# Altium project Buck_Converter.PrjPcb
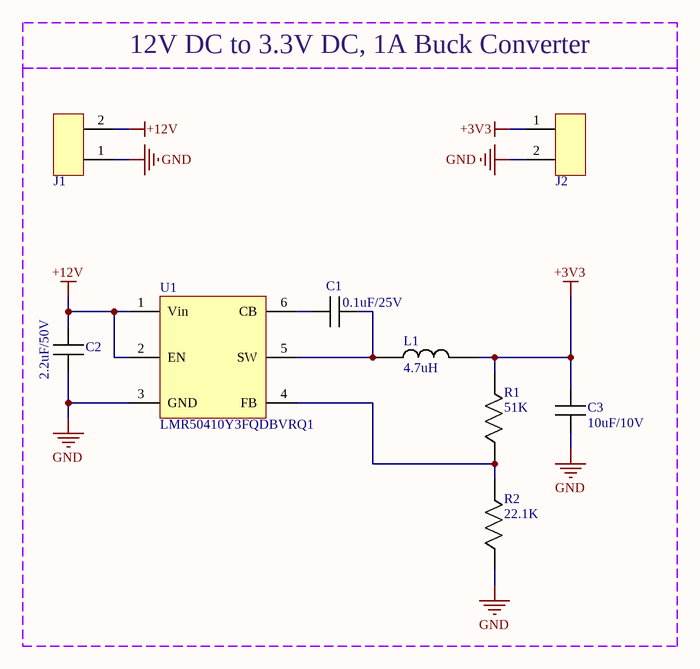
[diagram p0: Buck Converter.SchDoc]
1 sheet, 9 parts. Net scope: global (net labels, ports and power ports of the same name join across sheets).
Board file: Buck Converter.PcbDoc

## Sheet Buck Converter.SchDoc
size A3; SheetNumber: 1; SheetTotal: 1

### Parts
C1  0.1uF/25V  [CAP 0805]
C2  2.2uF/50V  [CAP 0805]
C3  10uF/10V  [CAP 0805]
J1  Header x2  [HEADER X2]  (value not drawn)
J2  Header x2  [HEADER X2]  (value not drawn)
L1  4.7uH  [IND_0628]
R1  51K  [RES 0805]
R2  22.1K  [RES 0805]
U1  LMR50410Y3FQDBVRQ1  [SOT23-6]

### Nets
+3V3: C3.2 J2.1 L1.2 R1.2
+12V: C2.2 J1.2 U1.1(Vin) U1.2(EN)
GND: C2.1 C3.1 J1.1 J2.2 R2.1 U1.3(GND)
NetC1_1: C1.1 L1.1 U1.5(SW)
NetC1_2: C1.2 U1.6(CB)
NetR1_1: R1.1 R2.2 U1.4(FB)

### Notes on the sheet
- 12V DC to 3.3V DC, 1A Buck Converter
- TANIM / DESCRIPTION
- DOSYA ADI / FILE NAME
- HAZIRLAYAN / PREPARED BY
- KONTROL EDEN / CHECKED BY
- YAYIN TARİHİ / REL DATE
- COMPANY NAME
- ONAYLAYAN / APPROVED BY
- ELECTRICAL - ELECTRONICS
- BÖLÜM  DEPARTMENT
- BOYUT / SIZE
- REVİZYON / REVISION
- SAYFA / SHEET
- ENGINEERING
- /

### Library data of the parts
C1 = CAP CER 0.1uF: 0.1 µF ±20% 25V Ceramic Capacitor X7R 0805 (2012 Metric); Manufacturer: KEMET; Manufacturer Part Number: C0805C104M3RAC7210; Supplier 1: Digikey; RoHS: Yes; Category: Ceramic Capacitors; Stock 1: 27572; Pricing 1: 1=0,1, 10=0,035, 100=0,0213, 1000=0,01423, 2500=0,01239, 5000=0,01125 (USD); RoHS Compliant: Yes; Supplier Part Number 1: 399-C0805C104M3RAC7210CT-ND
C2 = CAP CER 2.2uF: 2.2 µF ±10% 50V Ceramic Capacitor X7R 0805 (2012 Metric); Manufacturer: Yageo; Manufacturer Part Number: CC0805KKX7R9BB225; Material: 4241ConductorMaterial; Capacitance: 2.2uF; Supplier 1: Digikey; RoHS: Yes; Category: Ceramic Capacitors; Stock 1: 152900; Pricing 1: 1=0,33, 10=0,217, 100=0,1313, 1000=0,1036 (USD); Mount: Surface Mount; Case/Package: 0805; Case Code (Imperial): 0805; Case Code (Metric): 2012; Weight: 0.000194oz; Min Operating Temperature: -55°C; Max Operating Temperature: 125°C; Packaging: Tape and Reel; Voltage Rating: 50V; Tolerance: 10%; Dielectric: X7R; Termination: SMD/SMT; Voltage Rating (DC): 50V; Package Quantity: 3000; Series: CC; Length: 0.079inch; Width: 0.049inch; Height: 950um; Thickness: 0.057inch; Lead Free: Lead Free; Halogen Free: Halogen Free; RoHS Compliant: Yes; ComponentLink1URL: http://www.mouser.com/ds/2/447/Yageo_UPY-GP_NP0_16V-to-50V_9-358835.pdf?src-supplier=Mouser; ComponentLink1Description: http://www.mouser.com/ds/2/447/Yageo_UPY-GP_NP0_16V-to-50V_9-358835.pdf?src-supplier=Mouser; ComponentLink2URL: https://datasheet.octopart.com/CC0805KKX7R9BB225-Yageo-datasheet-166511530.pdf?src-supplier=Future+Electronics; ComponentLink2Description: https://datasheet.octopart.com/CC0805KKX7R9BB225-Yageo-datasheet-166511530.pdf?src-supplier=Future+Electronics; ComponentLink3URL: http://www.yageo.com/documents/recent/UPY-GPHC_X7R_6.3V-to-50V_18.pdf?src-supplier=Digikey; ComponentLink3Description: http://www.yageo.com/documents/recent/UPY-GPHC_X7R_6.3V-to-50V_18.pdf?src-supplier=Digikey; ComponentLink4URL: https://datasheet.octopart.com/CC0805KKX7R9BB225-Yageo-datasheet-151948686.pdf?src-supplier=Farnell; ComponentLink4Description: https://datasheet.octopart.com/CC0805KKX7R9BB225-Yageo-datasheet-151948686.pdf?src-supplier=Farnell; Supplier Part Number 1: 311-3420-6-ND
C3 = CAP CER 10uF: 10 µF ±10% 10V Ceramic Capacitor X7R 0805 (2012 Metric); Manufacturer: Murata; Manufacturer Part Number: GRM21BR71A106KA73L; Material: 4241ConductorMaterial; Capacitance: 10uF; Supplier 1: Digikey; RoHS: Yes; Category: Ceramic Capacitors; Stock 1: 594213; Pricing 1: 1=0,13, 10=0,081, 100=0,0518, 1000=0,03306 (USD); Mount: Surface Mount; Case/Package: 0805; Number of Pins: 2NUMBER; Case Code (Metric): 2012; Case Code (Imperial): 0805; Weight: 0.000335oz; Min Operating Temperature: -55°C; Max Operating Temperature: 125°C; Packaging: Tape and Reel; Voltage Rating: 10V; Termination: SMD/SMT; Voltage Rating (DC): 10V; Package Quantity: 3000; Series: GRM; Tolerance: 10%; Dielectric: X7R; Length: 0.079inch; Width: 0.049inch; Height: 1.25mm; Thickness: 0.055inch; RoHS Compliant: Yes; Reach SVHC Compliant: No; Supplier Part Number 1: 490-10516-1-ND
L1 = IND 4.7uH: Inductor Power Shielded/Molded Wirewound 4.7uH 20% 100KHz Ferrite 3A 0.031Ohm DCR 2424 T/R; Manufacturer: Abracon; Manufacturer Part Number: ASPI-0628-4R7M-T1; Supplier 1: Digikey; RoHS: Yes; Category: Fixed Inductors; Stock 1: 827; Pricing 1: 1=0,33, 10=0,275, 100=0,2202 (USD); ComponentLink1URL: http://www.abracon.com/Support/PackageDrawing/Magnetics/ASPI-0628.PDF?src-supplier=Digikey; ComponentLink1Description: http://www.abracon.com/Support/PackageDrawing/Magnetics/ASPI-0628.PDF?src-supplier=Digikey; ComponentLink2URL: https://abracon.com/Magnetics/new/ASPI-0628.pdf?src-supplier=Digikey; ComponentLink2Description: https://abracon.com/Magnetics/new/ASPI-0628.pdf?src-supplier=Digikey; ComponentLink3URL: https://datasheet.octopart.com/ASPI-0628-4R7M-T1-Abracon-datasheet-141160310.pdf?src-supplier=Sager+Electronics; ComponentLink3Description: https://datasheet.octopart.com/ASPI-0628-4R7M-T1-Abracon-datasheet-141160310.pdf?src-supplier=Sager+Electronics; Supplier Part Number 1: 535-12806-1-ND
R1 = RES 51 KOHM: 51 kOhms ±1% 0.125W, 1/8W Chip Resistor 0805 (2012 Metric) Moisture Resistant Thick Film; Manufacturer: Yageo; Manufacturer Part Number: RC0805FR-0751KL; Resistance: 51kR; Power Rating: 125mW; Voltage Rating: 150V; Temperature Coefficient: 100ppm/°C; Supplier 1: Digikey; RoHS: Yes; Category: Chip SMD Resistors; Stock 1: 127291; Pricing 1: 1=0,1, 10=0,014, 100=0,0092, 1000=0,00714 (USD); Mount: Surface Mount; Case/Package: 0805; Case Code (Metric): 2012; Case Code (Imperial): 0805; Size Code: 0805; Min Operating Temperature: -55°C; Max Operating Temperature: 155°C; Package Quantity: 1; Tolerance: 1%; Packaging: Tape and Reel; Number of Terminations: 2; Termination: SMD/SMT; Max Power Dissipation: 125mW; Features: Moisture Resistant; Series: RC; Construction: Rectangular; Technology: THICK FILM; Voltage Rating (DC): 150V; Length: 0.079inch; Width: 0.049inch; Height: 0.024inch; Depth: 1.25mm; Military Standard: Not; Lead Free: Lead Free; RoHS Compliant: Yes; ComponentLink1URL: https://datasheet.ciiva.com/11808/0900766b8106beab-11808330.pdf?src-supplier=Rs; ComponentLink1Description: https://datasheet.ciiva.com/11808/0900766b8106beab-11808330.pdf?src-supplier=Rs; ComponentLink2URL: https://datasheet.ciiva.com/2457/pyu-r-int-thick-7-2457012.pdf?src-supplier=Digikey; ComponentLink2Description: https://datasheet.ciiva.com/2457/pyu-r-int-thick-7-2457012.pdf?src-supplier=Digikey; ComponentLink3URL: https://datasheet.ciiva.com/2457/pyu-r-int-thick-7-2457013.pdf?src-supplier=Digikey; ComponentLink3Description: https://datasheet.ciiva.com/2457/pyu-r-int-thick-7-2457013.pdf?src-supplier=Digikey; ComponentLink4URL: https://datasheet.ciiva.com/2457/pyu-r-int-thick-7-2457011.pdf?src-supplier=Digikey; ComponentLink4Description: https://datasheet.ciiva.com/2457/pyu-r-int-thick-7-2457011.pdf?src-supplier=Digikey; ComponentLink5URL: https://datasheet.ciiva.com/5596/rc0805-5596026.pdf?src-supplier=Mouser; ComponentLink5Description: https://datasheet.ciiva.com/5596/rc0805-5596026.pdf?src-supplier=Mouser; ComponentLink6URL: https://datasheet.ciiva.com/15189/getdatasheetpartid-323948-15189990.pdf?src-supplier=Verical; ComponentLink6Description: https://datasheet.ciiva.com/15189/getdatasheetpartid-323948-15189990.pdf?src-supplier=Verical; ComponentLink7URL: https://datasheet.ciiva.com/16746/rc0805-16746823.pdf?src-supplier=Future+Electronics; ComponentLink7Description: https://datasheet.ciiva.com/16746/rc0805-16746823.pdf?src-supplier=Future+Electronics; Supplier Part Number 1: 311-51.0KCRCT-ND
R2 = RES 22.1 KOHM: SMD Chip Resistor, 22.1 kOhm, ± 1%, 125 mW, 0805 [2012 Metric], Thick Film, General Purpose; Manufacturer: Yageo; Manufacturer Part Number: RC0805FR-0722K1L; Voltage Rating (DC): 150V; Supplier 1: Digikey; RoHS: Yes; Category: Chip SMD Resistors; Stock 1: 60840; Pricing 1: 1=0,1, 10=0,014, 100=0,0092, 1000=0,00714 (USD); Lead Free: 5697LeadFree; ComponentLink1URL: https://datasheet.ciiva.com/12557/rc0805-257173-12557879.pdf?src-supplier=Mouser; ComponentLink1Description: https://datasheet.ciiva.com/12557/rc0805-257173-12557879.pdf?src-supplier=Mouser; ComponentLink2URL: https://datasheet.ciiva.com/2519/pyu-r-int-thick-7-2519759.pdf?src-supplier=Digikey; ComponentLink2Description: https://datasheet.ciiva.com/2519/pyu-r-int-thick-7-2519759.pdf?src-supplier=Digikey; ComponentLink3URL: https://datasheet.ciiva.com/2519/pyu-r-int-thick-7-2519760.pdf?src-supplier=Digikey; ComponentLink3Description: https://datasheet.ciiva.com/2519/pyu-r-int-thick-7-2519760.pdf?src-supplier=Digikey; ComponentLink4URL: https://datasheet.ciiva.com/2519/pyu-r-int-thick-7-2519761.pdf?src-supplier=Digikey; ComponentLink4Description: https://datasheet.ciiva.com/2519/pyu-r-int-thick-7-2519761.pdf?src-supplier=Digikey; Supplier Part Number 1: 311-22.1KCRCT-ND
U1 = LMR50410Y3FQDBVRQ1: Switching Regulator, Current-mode, 1A, 2100kHz Switching Freq-Max, PDSO6; Manufacturer: Texas Instruments; Supplier 1: Digikey; Manufacturer Part Number: LMR50410Y3FQDBVRQ1; RoHS: Yes; Category: Voltage Regulators - Switching; Stock 1: 7505; Pricing 1: 1=1,47, 10=1,074, 25=0,974, 100=0,8645, 250=0,81228, 500=0,78078, 1000=0,75486 (USD); Supplier Part Number 1: 296-LMR50410Y3FQDBVRQ1CT-ND